# Altium schematic sheet PMIC.SchDoc: PMIC
size A4; Organization: Energy Auditor; Address1: Sensor Node; Address3: University of Colorado; Address4: Boulder; DocumentNumber: 2; Revision: 1; SheetNumber: 2; SheetTotal: 6
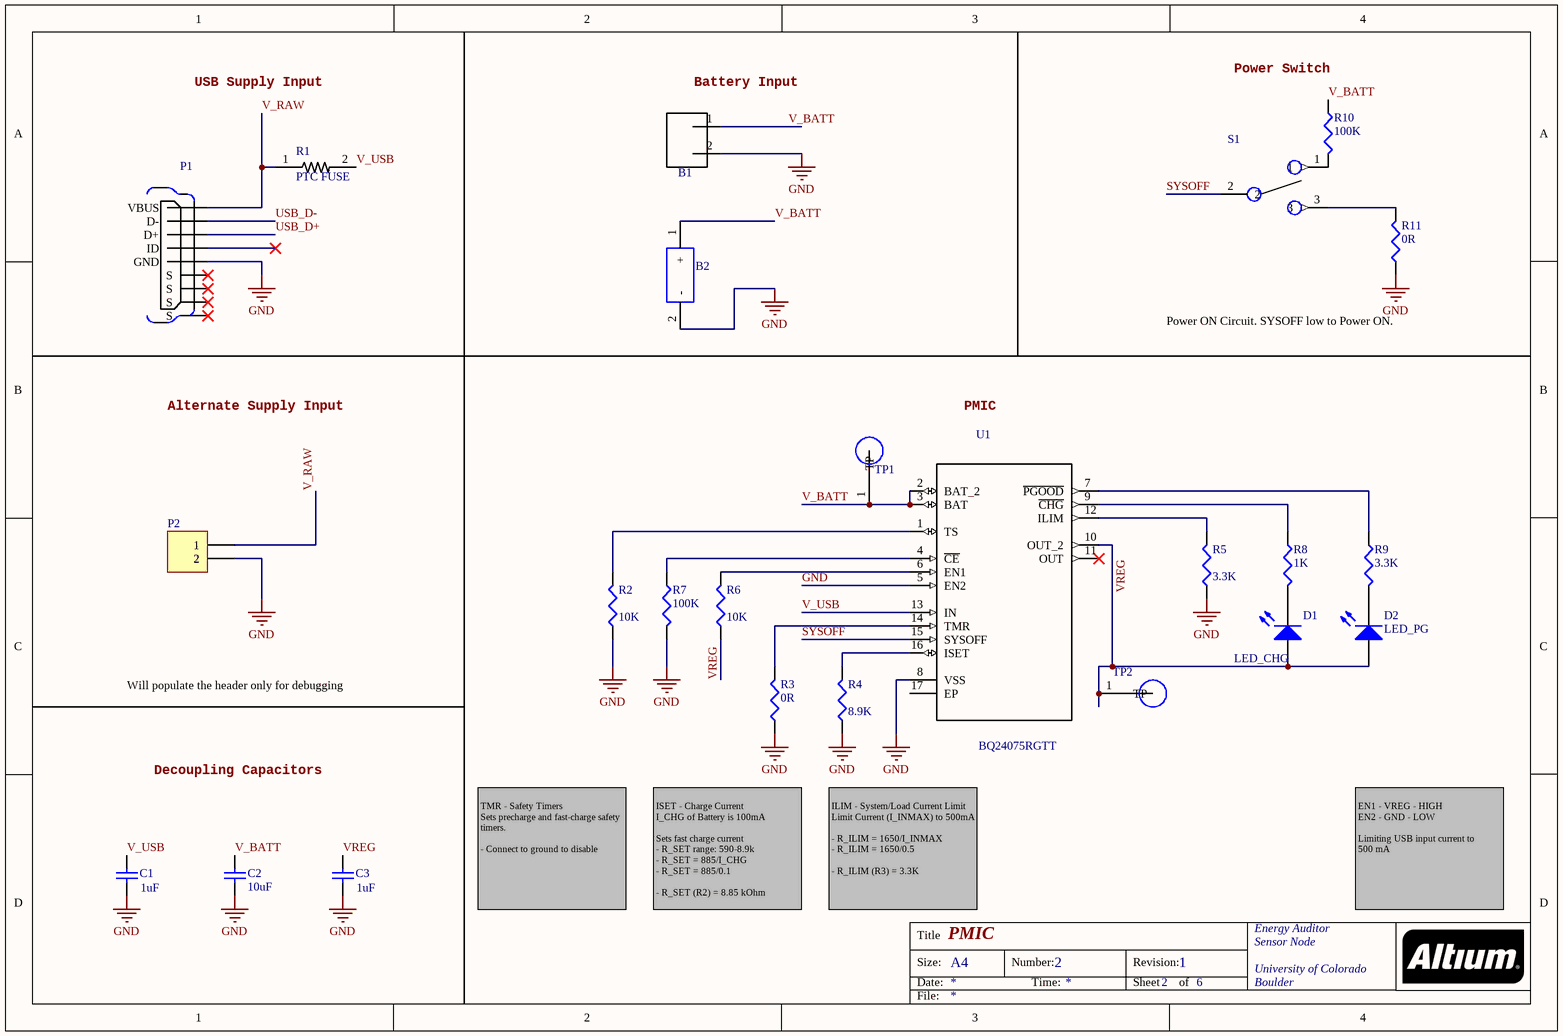
[diagram p0: PMIC.SchDoc]

## Parts
B1  S2B-PH-SM4-TB(LF)(SN)  [S2B-PH-SM4-TB(LF)(SN)]  (value not drawn)
B2  SMTU2450N-LF_BULK  [SMTU2430-LF]  (value not drawn)
C1  1uF  [1608[0603]]
C2  10uF  [1608[0603]]
C3  1uF  [1608[0603]]
D1  LED_CHG  [1608[0603]]
D2  LED_PG  [1608[0603]]
P1  10104111-0001LF  [FRAMATOME_10104111-0001LF]  (value not drawn)
P2  Header 2  [HDR1X2]  (value not drawn)
R1  PTC FUSE  [RESC3216X125N]
R2  10K  [1608[0603]]
R3  0R  [1608[0603]]
R4  8.9K  [1608[0603]]
R5  3.3K  [1608[0603]]
R6  10K  [1608[0603]]
R7  100K  [1608[0603]]
R8  1K  [1608[0603]]
R9  3.3K  [1608[0603]]
R10  100K  [1608[0603]]
R11  0R  [1608[0603]]
S1  AYZ0102AGRLC  [SW_AYZ0102AGRLC]  (value not drawn)
TP1  5019  [TP380X203]  (value not drawn)
TP2  5019  [TP380X203]  (value not drawn)
U1  BQ24075RGTT  [QFN50P300X300X100-17N]

## Nets
GND: B1.2 B2.2(-) C1.1 C2.1 C3.1 P1.5(GND) P2.2 R2.1 R3.1 R4.1 R5.1 R7.2 R11.1 U1.5(EN2) U1.8(VSS)
SYSOFF: S1.2 U1.15(SYSOFF)
USB_D+: P1.3(D+)
USB_D-: P1.2(D-)
V_BATT: B1.1 B2.1(+) C2.2 R10.1 TP1.1(TP) U1.2(BAT_2) U1.3(BAT)
V_RAW: P1.1(VBUS) P2.1 R1.1
V_USB: C1.2 R1.2 U1.13(IN)
VREG: C3.2 D1.1(A) D2.1(A) R6.1 TP2.1(TP) U1.10(OUT_2)
NetD1_2: D1.2(K) R8.2
NetD2_2: D2.2(K) R9.2
NetR2_2: R2.2 U1.1(TS)
NetR3_2: R3.2 U1.14(TMR)
NetR4_2: R4.2 U1.16(ISET)
NetR5_2: R5.2 U1.12(ILIM)
NetR6_2: R6.2 U1.6(EN1)
NetR7_1: R7.1 U1.4(~{CE})
NetR8_1: R8.1 U1.9(~{CHG})
NetR9_1: R9.1 U1.7(~{PGOOD})
NetR10_2: R10.2 S1.1
NetR11_2: R11.2 S1.3

Not connected (* = marked no-connect by the designer): P1 4(ID)* 6(S)* 7(S)* 8(S)* 9(S)*; U1 11(OUT)* 17(EP)

## Notes on the sheet
- USB Supply Input
- (near B1) Battery Input
- (near R10) Power Switch
- Power ON Circuit. SYSOFF low to Power ON.
- Alternate Supply Input
- PMIC
- Will populate the header only for debugging
- Decoupling Capacitors
- TMR - Safety Timers
  Sets precharge and fast-charge safety
  timers.
  - Connect to ground to disable
- ISET - Charge Current
  I_CHG of Battery is 100mA
  Sets fast charge current
  - R_SET range: 590-8.9k
  - R_SET = 885/I_CHG
  - R_SET = 885/0.1
  - R_SET (R2) = 8.85 kOhm
- ILIM - System/Load Current Limit
  Limit Current (I_INMAX) to 500mA
  - R_ILIM = 1650/I_INMAX
  - R_ILIM = 1650/0.5
  - R_ILIM (R3) = 3.3K
- EN1 - VREG - HIGH
  EN2 - GND - LOW
  Limiting USB input current to
  500 mA
- Title
- Size:
- Date:
- A4
- Number:
- Time:
- Revision:
- Sheet
- of
- File:

## Library data of the parts
B1 = S2B-PH-SM4-TB(LF)(SN): PH Series 2 Position 2 mm Pitch Surface Mount Side Entry Shrouded Header; Manufacturer: JST Sales America Inc.; Manufacturer Part Number: S2B-PH-SM4-TB(LF)(SN); Value: *; Digi-Key Part Number: 455-1749-1-ND; ComponentLInk1URL: https://www.digikey.com/products/en/connectors-interconnects/rectangular-connectors-headers-male-pins/314?k=S2B-PH-SM4-TB&k=&pkeyword=S2B-PH-SM4-TB&pv7=2&sf=0&quantity=&ColumnSort=0&page=1&pageSize=25; ComponentLink1Description: Digi-Key Link
B2 = SMTU2450N-LF_BULK: Coin Cell Battery Holders SFC MNT FOR CR2450N; Manufacturer: RENATA; Manufacturer Part Number: SMTU2450N-LF BULK; Mouser Part Number: 614-SMTU2450N-LF; ComponentLink1URL: https://www.mouser.com/ProductDetail/Renata/SMTU2450N-LF-BULK?qs=LsPilcdHE7Gn4SDnejz9jQ%3D%3D; ComponentLink1Description: Mouser Link
C1 C3 = Cap: CAP CER 1UF 16V X7R 0603; Manufacturer: Samsung Electro-Mechanics; Manufacturer Part Number: CL10B105MO8NNWC; Value: 1uF; Digi-Key Part Number: 1276-6524-1-ND; ComponentLink1URL: https://www.digikey.com/product-detail/en/samsung-electro-mechanics/CL10B105MO8NNWC/1276-6524-1-ND/5961383; ComponentLink1Description: Digi-Key Link
C2 = Cap Semi: CAP CER 10UF 10V X5R 0603; Manufacturer: Murata Electronics North America; Manufacturer Part Number: GRM188R61A106KE69D; Value: 10uF; Digi-Key Part Number: 490-10474-1-ND; ComponentLink1URL: https://www.digikey.com/products/en?keywords=490-10474-1-ND; ComponentLink1Description: Digi-Key Link
D1 = LED2: Blue 470nm LED Indication - Discrete 2.85V 0603 (1608 Metric); Manufacturer: OSRAM Opto Semiconductors Inc.; Manufacturer Part Number: LB Q39G-L2OO-35-1; Digi-Key Part Number: 475-2816-1-ND; ComponentLink1URL: https://www.digikey.com/product-detail/en/osram-opto-semiconductors-inc/LB-Q39G-L2OO-35-1/475-2816-1-ND/2176355; ComponentLink1Description: Digi-Key Link
D2 = LED2: LED GREEN DIFFUSED 0603 SMD; Manufacturer: OSRAM Opto Semiconductors Inc.; Manufacturer Part Number: LG L29K-F2J1-24-Z; Digi-Key Part Number: 475-3118-1-ND; ComponentLink1URL: https://www.digikey.com/product-detail/en/osram-opto-semiconductors-inc/LG-L29K-F2J1-24-Z/475-3118-1-ND/4899549; ComponentLink1Description: Digi-Key Link
P1 = 10104111-0001LF: Micro Usb, 2.0 Type Ab, Receptacle, Th; Manufacturer: Amphenol FCI; Digi-Key Part Number: 609-4053-1-ND; ComponentLink1URL: https://www.digikey.com/product-detail/en/amphenol-fci/10104111-0001LF/609-4053-1-ND/2350359?utm_source=snapeda&utm_medium=aggregator&utm_campaign=symbol; Manufacturer Part Number: 10104111-0001LF; Value: *; ComponentLink1Description: Digi-Key Link
P2 = Header 2: Header, 2-Pin
R1 = 0ZCA0075FF2G: PTC RESET FUSE 6V 500MA 1206; Manufacturer: Bel Fuse; Manufacturer Part Number: Littelfuse Inc.; Value: *; Digi-Key Part Number: F2112CT-ND; ComponentLink1URL: https://www.digikey.com/product-detail/en/littelfuse-inc/1206L050YR/F2112CT-ND/455721; ComponentLink1Description: Digi-Key Link
R2 R6 = Res3: RES SMD 10K OHM 1% 1/8W 0603; Manufacturer: Vishay Beyschlag; Manufacturer Part Number: MCT06030C1002FP500; Value: 10K; Digi-Key Part Number: MCT0603-10.0K-CFCT-ND; ComponentLink1URL: https://www.digikey.com/products/en?keywords=MCT0603-10.0K-CFCT-ND; ComponentLink1Description: Digi-Key Link
R3 R11 = Res3: RES 0 OHM JUMPER 1/8W 0603; Manufacturer: Vishay Beyschlag; Manufacturer Part Number: MCT0603MZ0000ZP500; Value: 0R; Digi-Key Part Number: 749-1745-1-ND; ComponentLink1URL: https://www.digikey.com/product-detail/en/vishay-beyschlag/MCT0603MZ0000ZP500/749-1745-1-ND/7348053; ComponentLink1Description: Digi-Key Link
R4 = Res3: RES SMD 8.87KOHM 0.5% 1/10W 0603; Manufacturer: Yageo; Manufacturer Part Number: RT0603DRD078K87L; Value: 8.9K; Digi-Key Part Number: 311-8.87KDCT-ND; ComponentLink1URL: https://www.digikey.com/product-detail/en/yageo/RT0603DRD078K87L/311-8.87KDCT-ND/1035893; ComponentLink1Description: Digi-Key Link
R5 R9 = Res3: RES SMD 3.3K OHM 5% 1/10W 0603; Manufacturer: Panasonic Electronic Components; Manufacturer Part Number: ERJ-3GEYJ332V; Value: 3.3K; Digi-Key Part Number: P3.3KGCT-ND; ComponentLink1URL: https://www.digikey.com/product-detail/en/panasonic-electronic-components/ERJ-3GEYJ332V/P3.3KGCT-ND/135146; ComponentLink1Description: Digi-Key Link
R7 R10 = Res3: RES SMD 100K OHM 0.1% 1/10W 0603; Manufacturer: Susumu; Manufacturer Part Number: RG1608P-104-B-T5; Value: 100K; Digi-Key Part Number: RG16P100KBCT-ND; ComponentLink1URL: https://www.digikey.com/products/en/resistors/chip-resistor-surface-mount/52?k=RG1608P-104-B-T5&k=&pkeyword=RG1608P-104-B-T5&pv7=2&sf=0&quantity=&ColumnSort=0&page=1&pageSize=25; ComponentLink1Description: Digi-Key Link
R8 = Res3: RES SMD 1K OHM 0.1% 1/10W 0603; Manufacturer: Yageo; Manufacturer Part Number: RT0603BRD071KL; Value: 1K; Digi-Key Part Number: YAG1237CT-ND; ComponentLink1URL: https://www.digikey.com/product-detail/en/yageo/RT0603BRD071KL/YAG1237CT-ND/4340590; ComponentLink1Description: Digi-Key Link
S1 = AYZ0102AGRLC: SWITCH SLIDE SPDT 100MA 12V; Manufacturer: C&K; Digi-Key Part Number: 401-2012-1-ND; Manufacturer Part Number: AYZ0102AGRLC; ComponentLink1URL: https://www.digikey.com/products/en/switches/slide-switches/213?k=AYZ0102AGRLC&k=&pkeyword=AYZ0102AGRLC&pv7=2&sf=0&quantity=&ColumnSort=0&page=1&pageSize=25; ComponentLink1Description: Digi-Key Link
TP1 TP2 = 5019: Phosphor Bronze Contact Miniature Silver Plated Surface Mount Test Points; Manufacturer: Keystone; Manufacturer Part Number: 5019; Digi-Key Part Number: 36-5019CT-ND; ComponentLink1URL: https://www.digikey.com/product-detail/en/keystone-electronics/5019/36-5019CT-ND/3907344?utm_source=snapeda&utm_medium=aggregator&utm_campaign=symbol; Value: *; ComponentLink1Description: Digi-Key Link
U1 = BQ24075RGTT: USB-Friendly Li-Ion Battery Charger and Power-Path Management IC, Vout 5.5V 16-QFN -40 to 85; Manufacturer: Texas Instruments; Manfacturer Part Number: BQ24075RGTT; Availability: Unavailable; Value: *; Digi-Key Part Number: 296-38874-1-ND; ComponentLink1Description: Digi-Key Link; ComponentLink1URL: https://www.digikey.com/products/en/integrated-circuits-ics/pmic-battery-chargers/781?k=BQ24075RGTR&k=&pkeyword=BQ24075RGTR&pv7=2&sf=0&quantity=&ColumnSort=0&page=1&pageSize=25